# EAGLE schematic V1-MOUSE-REVIEW (EAGLE 9.7.0)
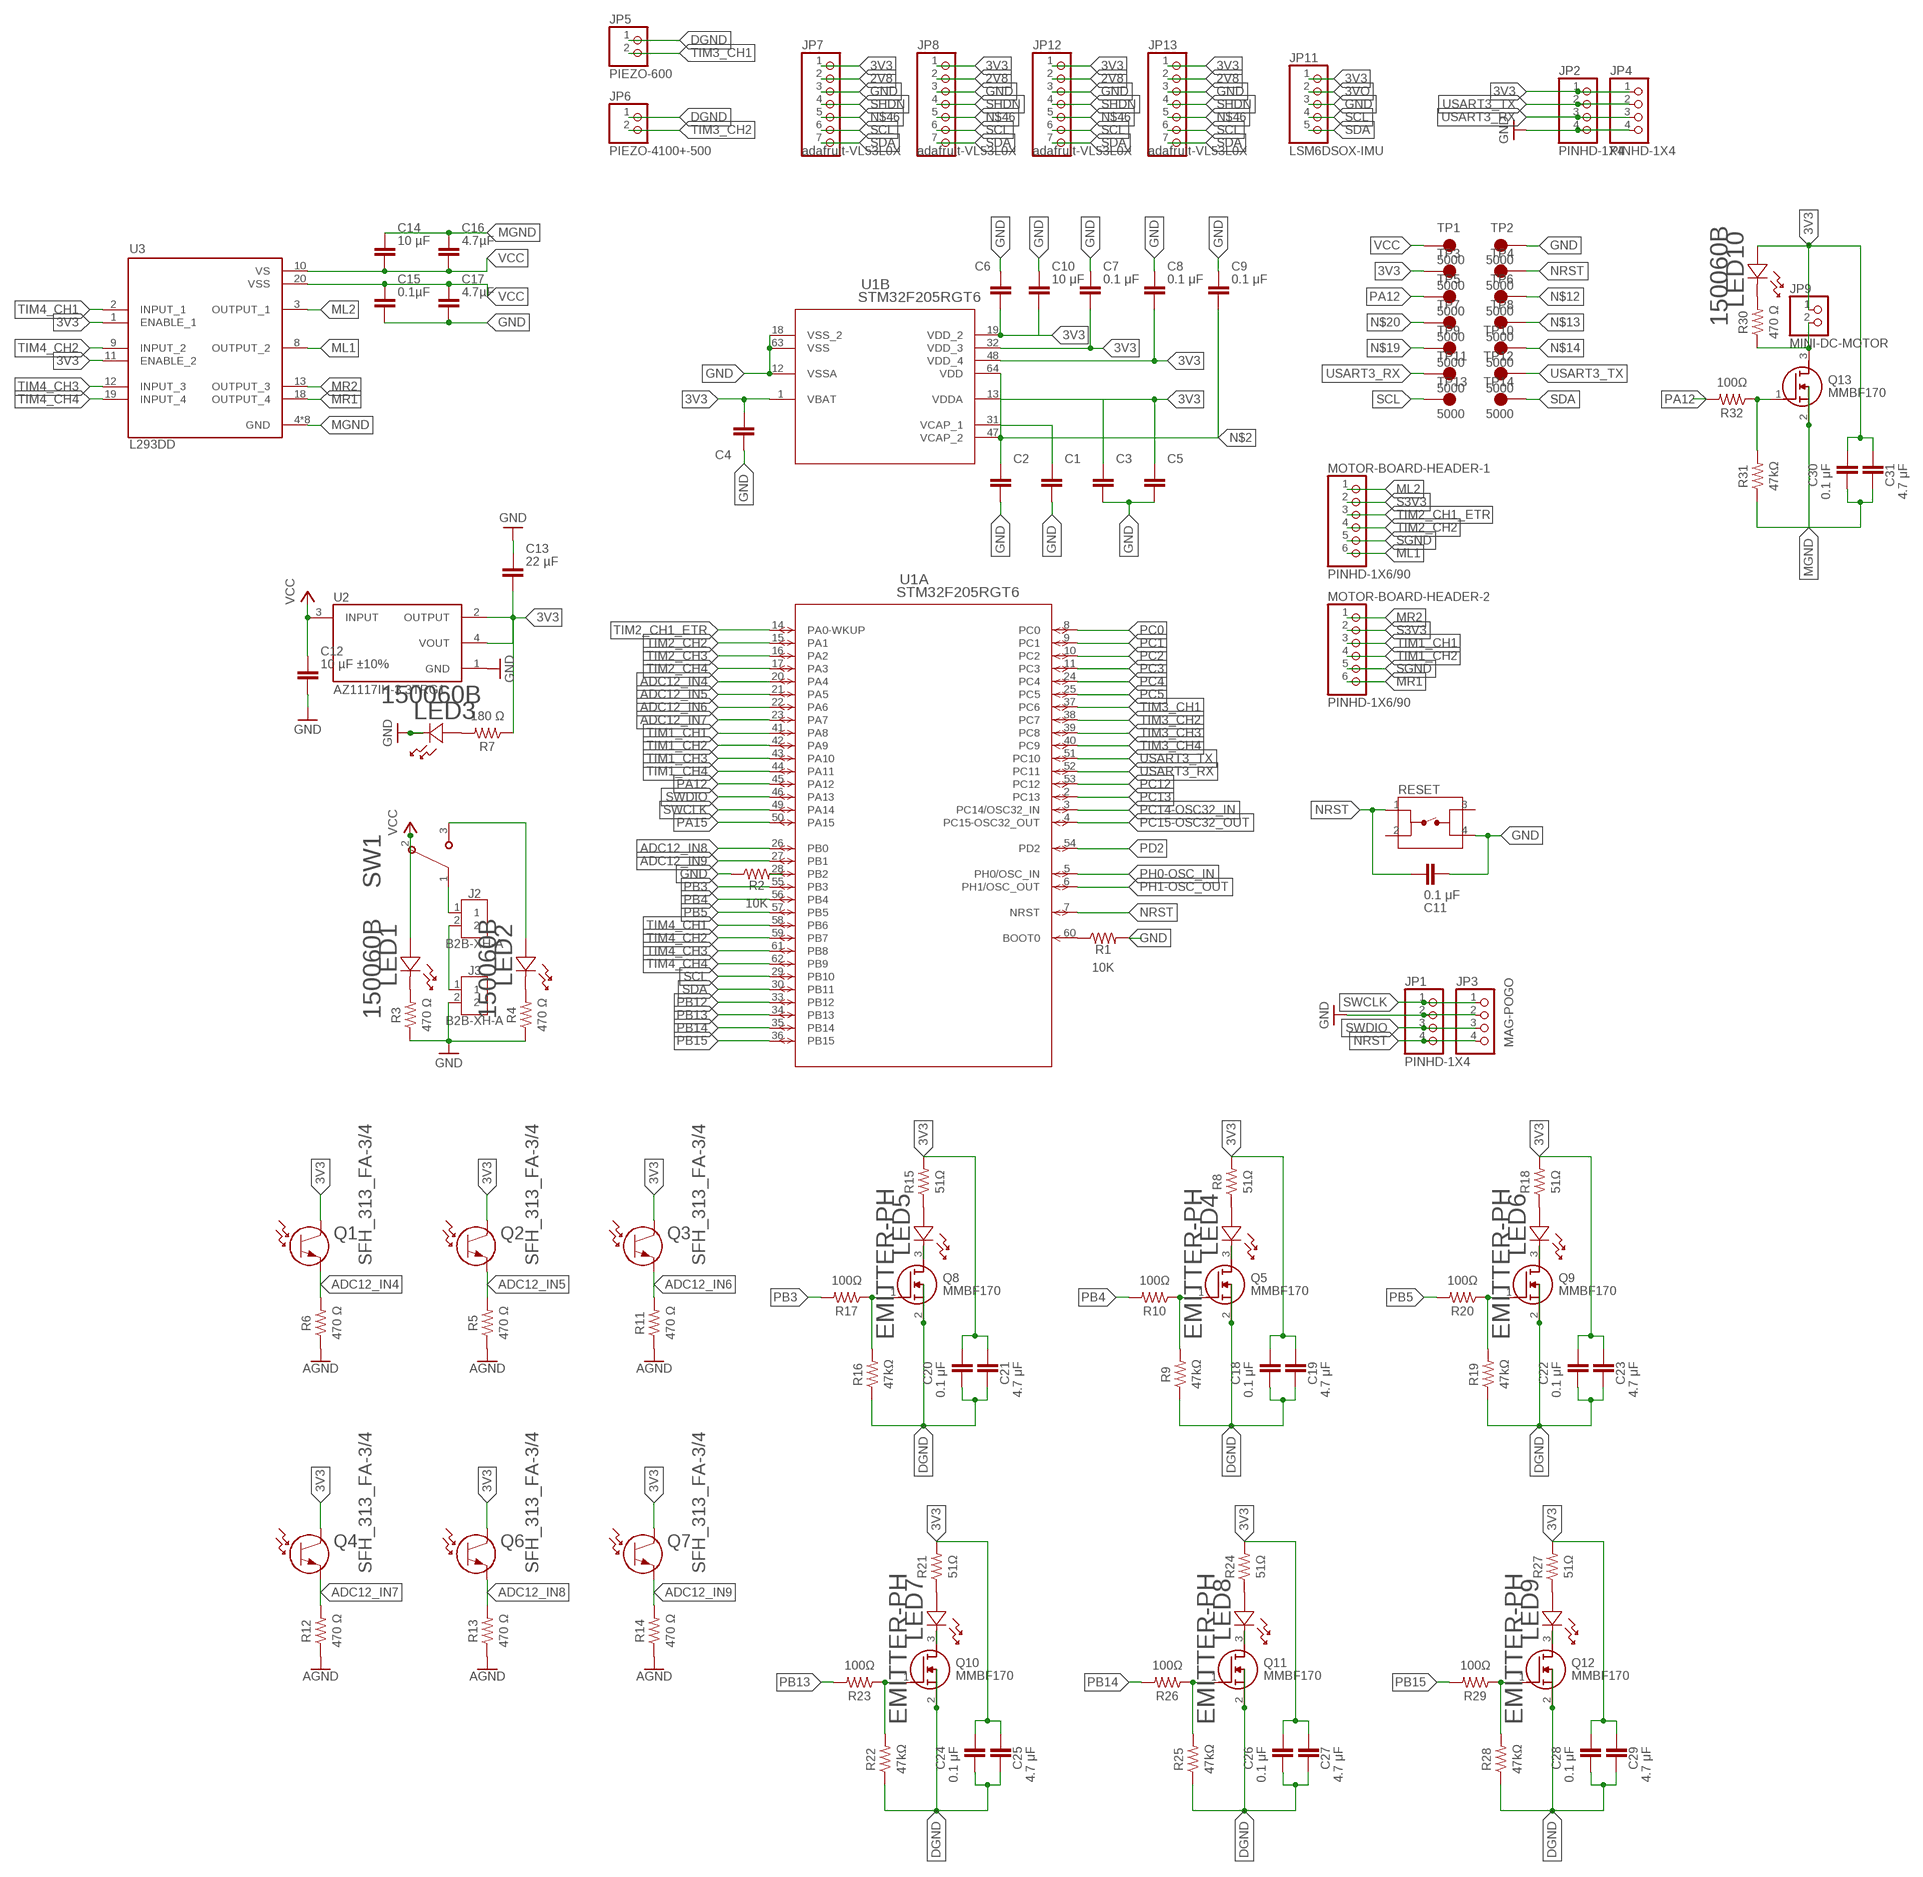
[diagram p0: schematic, sheet 1]

## Parts
C1  2.2 μF  C_CHIP-0603(1608-METRIC)  [CAPC1608X85]
C2  2.2 μF  C_CHIP-0603(1608-METRIC)  [CAPC1608X85]
C3  0.1 μF  C_CHIP-0603(1608-METRIC)  [CAPC1608X85]
C4  0.1 μF  C_CHIP-0603(1608-METRIC)  [CAPC1608X85]
C5  1 μF  C_CHIP-0603(1608-METRIC)  [CAPC1608X85]
C6  0.1 μF  C_CHIP-0603(1608-METRIC)  [CAPC1608X85]
C7  0.1 μF  C_CHIP-0603(1608-METRIC)  [CAPC1608X85]
C8  0.1 μF  C_CHIP-0603(1608-METRIC)  [CAPC1608X85]
C9  0.1 μF  C_CHIP-0603(1608-METRIC)  [CAPC1608X85]
C10  10 μF  C_CHIP-0603(1608-METRIC)  [CAPC1608X85]
C11  0.1 μF  C_CHIP-0603(1608-METRIC)  [CAPC1608X85]
C12  10 µF ±10%  C_CHIP-0603(1608-METRIC)  [CAPC1608X85]
C13  22 µF  C_CHIP-0603(1608-METRIC)  [CAPC1608X85]
C14  10 µF  C_CHIP-0603(1608-METRIC)  [CAPC1608X85]
C15  0.1µF  C_CHIP-0603(1608-METRIC)  [CAPC1608X85]
C16  4.7µF  C_CHIP-0603(1608-METRIC)  [CAPC1608X85]
C17  4.7µF  C_CHIP-0603(1608-METRIC)  [CAPC1608X85]
C18  0.1 μF  C_CHIP-0603(1608-METRIC)  [CAPC1608X85]
C19  4.7 μF  C_CHIP-0603(1608-METRIC)  [CAPC1608X85]
C20  0.1 μF  C_CHIP-0603(1608-METRIC)  [CAPC1608X85]
C21  4.7 μF  C_CHIP-0603(1608-METRIC)  [CAPC1608X85]
C22  0.1 μF  C_CHIP-0603(1608-METRIC)  [CAPC1608X85]
C23  4.7 μF  C_CHIP-0603(1608-METRIC)  [CAPC1608X85]
C24  0.1 μF  C_CHIP-0603(1608-METRIC)  [CAPC1608X85]
C25  4.7 μF  C_CHIP-0603(1608-METRIC)  [CAPC1608X85]
C26  0.1 μF  C_CHIP-0603(1608-METRIC)  [CAPC1608X85]
C27  4.7 μF  C_CHIP-0603(1608-METRIC)  [CAPC1608X85]
C28  0.1 μF  C_CHIP-0603(1608-METRIC)  [CAPC1608X85]
C29  4.7 μF  C_CHIP-0603(1608-METRIC)  [CAPC1608X85]
C30  0.1 μF  C_CHIP-0603(1608-METRIC)  [CAPC1608X85]
C31  4.7 μF  C_CHIP-0603(1608-METRIC)  [CAPC1608X85]
J2  B2B-XH-A  [B2B-XH-A]
J3  B2B-XH-A  [B2B-XH-A]
JP1  PINHD-1X4  [1X04]
JP2  PINHD-1X4  [1X04]
JP3  MAG-POGO  PINHD-1X4  [1X04]
JP4  PINHD-1X4  [1X04]
JP5  PIEZO-600  PINHD-1X2/90  [1X02/90]
JP6  PIEZO-4100+-500  PINHD-1X2/90  [1X02/90]
JP7  adafruit-VL53L0X  PINHD-1X7/90  [1X07/90]
JP8  adafruit-VL53L0X  PINHD-1X7/90  [1X07/90]
JP9  MINI-DC-MOTOR  PINHD-1X2  [1X02]
JP11  LSM6DSOX-IMU  PINHD-1X55X2MM  [1_05X2MM]
JP12  adafruit-VL53L0X  PINHD-1X7/90  [1X07/90]
JP13  adafruit-VL53L0X  PINHD-1X7/90  [1X07/90]
LED1  150060B  150060VS55040LED_150060B_WRE-L  [LED_150060B_WRE-L]
LED2  150060B  150060VS55040LED_150060B_WRE-L  [LED_150060B_WRE-L]
LED3  150060B  150060VS55040LED_150060B_WRE-L  [LED_150060B_WRE-L]
LED4  EMITTER-PH  B1911PG--20D000514U1930LED_B1911PG--20D000514U1930_01  [LED_B1911PG--20D000514U1930_01]
LED5  EMITTER-PH  B1911PG--20D000514U1930LED_B1911PG--20D000514U1930_01  [LED_B1911PG--20D000514U1930_01]
LED6  EMITTER-PH  B1911PG--20D000514U1930LED_B1911PG--20D000514U1930_01  [LED_B1911PG--20D000514U1930_01]
LED7  EMITTER-PH  B1911PG--20D000514U1930LED_B1911PG--20D000514U1930_01  [LED_B1911PG--20D000514U1930_01]
LED8  EMITTER-PH  B1911PG--20D000514U1930LED_B1911PG--20D000514U1930_01  [LED_B1911PG--20D000514U1930_01]
LED9  EMITTER-PH  B1911PG--20D000514U1930LED_B1911PG--20D000514U1930_01  [LED_B1911PG--20D000514U1930_01]
LED10  150060B  150060VS55040LED_150060B_WRE-L  [LED_150060B_WRE-L]
MOTOR-BOARD-HEADER-1  PINHD-1X6/90  [1X06/90]
MOTOR-BOARD-HEADER-2  PINHD-1X6/90  [1X06/90]
Q1  SFH_313_FA-3/4  SFH_313_FA-3/4SFH_313_FA-3/4_OSR  [SFH_313_FA-3/4_OSR]
Q2  SFH_313_FA-3/4  SFH_313_FA-3/4SFH_313_FA-3/4_OSR  [SFH_313_FA-3/4_OSR]
Q3  SFH_313_FA-3/4  SFH_313_FA-3/4SFH_313_FA-3/4_OSR  [SFH_313_FA-3/4_OSR]
Q4  SFH_313_FA-3/4  SFH_313_FA-3/4SFH_313_FA-3/4_OSR  [SFH_313_FA-3/4_OSR]
Q5  MMBF170  [SOT96P237X111-3N]
Q6  SFH_313_FA-3/4  SFH_313_FA-3/4SFH_313_FA-3/4_OSR  [SFH_313_FA-3/4_OSR]
Q7  SFH_313_FA-3/4  SFH_313_FA-3/4SFH_313_FA-3/4_OSR  [SFH_313_FA-3/4_OSR]
Q8  MMBF170  [SOT96P237X111-3N]
Q9  MMBF170  [SOT96P237X111-3N]
Q10  MMBF170  [SOT96P237X111-3N]
Q11  MMBF170  [SOT96P237X111-3N]
Q12  MMBF170  [SOT96P237X111-3N]
Q13  MMBF170  [SOT96P237X111-3N]
R1  10K  R-US_CHIP-0603(1608-METRIC)  [RESC1608X60]
R2  10K  R-US_CHIP-0603(1608-METRIC)  [RESC1608X60]
R3  470 Ω  R-US_CHIP-0603(1608-METRIC)  [RESC1608X60]
R4  470 Ω  R-US_CHIP-0603(1608-METRIC)  [RESC1608X60]
R5  470 Ω  R-US_CHIP-0603(1608-METRIC)  [RESC1608X60]
R6  470 Ω  R-US_CHIP-0603(1608-METRIC)  [RESC1608X60]
R7  180 Ω  R-US_CHIP-0603(1608-METRIC)  [RESC1608X60]
R8  51Ω  R-US_CHIP-0603(1608-METRIC)  [RESC1608X60]
R9  47kΩ  R-US_CHIP-0603(1608-METRIC)  [RESC1608X60]
R10  100Ω  R-US_CHIP-0603(1608-METRIC)  [RESC1608X60]
R11  470 Ω  R-US_CHIP-0603(1608-METRIC)  [RESC1608X60]
R12  470 Ω  R-US_CHIP-0603(1608-METRIC)  [RESC1608X60]
R13  470 Ω  R-US_CHIP-0603(1608-METRIC)  [RESC1608X60]
R14  470 Ω  R-US_CHIP-0603(1608-METRIC)  [RESC1608X60]
R15  51Ω  R-US_CHIP-0603(1608-METRIC)  [RESC1608X60]
R16  47kΩ  R-US_CHIP-0603(1608-METRIC)  [RESC1608X60]
R17  100Ω  R-US_CHIP-0603(1608-METRIC)  [RESC1608X60]
R18  51Ω  R-US_CHIP-0603(1608-METRIC)  [RESC1608X60]
R19  47kΩ  R-US_CHIP-0603(1608-METRIC)  [RESC1608X60]
R20  100Ω  R-US_CHIP-0603(1608-METRIC)  [RESC1608X60]
R21  51Ω  R-US_CHIP-0603(1608-METRIC)  [RESC1608X60]
R22  47kΩ  R-US_CHIP-0603(1608-METRIC)  [RESC1608X60]
R23  100Ω  R-US_CHIP-0603(1608-METRIC)  [RESC1608X60]
R24  51Ω  R-US_CHIP-0603(1608-METRIC)  [RESC1608X60]
R25  47kΩ  R-US_CHIP-0603(1608-METRIC)  [RESC1608X60]
R26  100Ω  R-US_CHIP-0603(1608-METRIC)  [RESC1608X60]
R27  51Ω  R-US_CHIP-0603(1608-METRIC)  [RESC1608X60]
R28  47kΩ  R-US_CHIP-0603(1608-METRIC)  [RESC1608X60]
R29  100Ω  R-US_CHIP-0603(1608-METRIC)  [RESC1608X60]
R30  470 Ω  R-US_CHIP-0603(1608-METRIC)  [RESC1608X60]
R31  47kΩ  R-US_CHIP-0603(1608-METRIC)  [RESC1608X60]
R32  100Ω  R-US_CHIP-0603(1608-METRIC)  [RESC1608X60]
RESET  FSM4JSMA  [TE_FSM4JSMA]
SW1  EG1218SW_1218_EWI  [SW_1218_EWI]
TP1  5000  [KEYSTONE_5000]
TP2  5000  [KEYSTONE_5000]
TP3  5000  [KEYSTONE_5000]
TP4  5000  [KEYSTONE_5000]
TP5  5000  [KEYSTONE_5000]
TP6  5000  [KEYSTONE_5000]
TP7  5000  [KEYSTONE_5000]
TP8  5000  [KEYSTONE_5000]
TP9  5000  [KEYSTONE_5000]
TP10  5000  [KEYSTONE_5000]
TP11  5000  [KEYSTONE_5000]
TP12  5000  [KEYSTONE_5000]
TP13  5000  [KEYSTONE_5000]
TP14  5000  [KEYSTONE_5000]
U1  STM32F205RGT6  [LQFP64-10X10MM]
U2  AZ1117IH-3.3TRG1  [SOT230P700X185-4N]
U3  L293DD  [SOIC127P1032X265-20N]

## Nets
2V8: JP7.2 JP8.2 JP12.2 JP13.2
3V3: C3.1 C4.2 C5.1 C6.2 C7.2 C8.2 C10.2 C13.2 C18.2 C19.2 C20.2 C21.2 C22.2 C23.2 C24.2 C25.2 C26.2 C27.2 C28.2 C29.2 C30.2 C31.2 JP2.1 JP4.1 JP7.1 JP8.1 JP9.1 JP11.1 JP12.1 JP13.1 LED10.2 Q1.2 Q2.2 Q3.2 Q4.2 Q6.2 Q7.2 R7.1 R8.2 R15.2 R18.2 R21.2 R24.2 R27.2 TP3.TP U1.1(B:VBAT) U1.13(B:VDDA) U1.19(B:VDD_2) U1.32(B:VDD_3) U1.48(B:VDD_4) U2.2(OUTPUT) U2.4(VOUT) U3.1(ENABLE_1) U3.11(ENABLE_2)
3VO: JP11.2
ADC12_IN4: Q1.1 R6.2 U1.20(A:PA4)
ADC12_IN5: Q2.1 R5.2 U1.21(A:PA5)
ADC12_IN6: Q3.1 R11.2 U1.22(A:PA6)
ADC12_IN7: Q4.1 R12.2 U1.23(A:PA7)
ADC12_IN8: Q6.1 R13.2 U1.26(A:PB0)
ADC12_IN9: Q7.1 R14.2 U1.27(A:PB1)
AGND: R5.1 R6.1 R11.1 R12.1 R13.1 R14.1
DGND: C18.1 C19.1 C20.1 C21.1 C22.1 C23.1 C24.1 C25.1 C26.1 C27.1 C28.1 C29.1 C30.1 C31.1 JP5.1 JP6.1 Q5.2(S) Q8.2(S) Q9.2(S) Q10.2(S) Q11.2(S) Q12.2(S) R9.1 R16.1 R19.1 R22.1 R25.1 R28.1 R31.1
GND: C1.2 C2.2 C3.2 C4.1 C5.2 C6.1 C7.1 C8.1 C9.1 C10.1 C11.1 C12.2 C13.1 C15.2 C17.2 J3.2 JP1.2 JP2.4 JP3.2 JP4.4 JP7.3 JP8.3 JP11.3 JP12.3 JP13.3 LED3.1 R1.2 R2.1 R3.1 R4.1 RESET.4 TP2.TP U1.12(B:VSSA) U1.18(B:VSS_2) U1.63(B:VSS) U2.1(GND)
MGND: C14.1 C16.1 Q13.2(S) U3.4(GND) U3.5(GND) U3.6(GND) U3.7(GND) U3.14(GND) U3.15(GND) U3.16(GND) U3.17(GND)
ML1: MOTOR-BOARD-HEADER-1.6 U3.8(OUTPUT_2)
ML2: MOTOR-BOARD-HEADER-1.1 U3.3(OUTPUT_1)
MR1: MOTOR-BOARD-HEADER-2.6 U3.18(OUTPUT_4)
MR2: MOTOR-BOARD-HEADER-2.1 U3.13(OUTPUT_3)
N$1: C1.1 U1.31(B:VCAP_1)
N$2: C2.1 C9.2 U1.47(B:VCAP_2) U1.64(B:VDD)
N$3: R1.1 U1.60(A:BOOT0)
N$4: R2.2 U1.28(A:PB2)
N$5: J2.2 J3.1
N$6: J2.1 SW1.1
N$7: LED1.1 R3.2
N$8: LED2.1 R4.2
N$9: LED2.2 SW1.3
N$10: JP9.2 Q13.3(D) R30.1
N$12: TP6.TP
N$13: TP8.TP
N$14: TP10.TP
N$16: Q13.1(G) R31.2 R32.1
N$17: LED10.1 R30.2
N$19: TP9.TP
N$20: TP7.TP
N$22: LED3.2 R7.2
N$27: LED4.1 Q5.3(D)
N$28: Q5.1(G) R9.2 R10.1
N$29: LED4.2 R8.1
N$30: LED5.2 R15.1
N$31: Q8.1(G) R16.2 R17.1
N$32: LED5.1 Q8.3(D)
N$33: LED6.1 Q9.3(D)
N$35: Q9.1(G) R19.2 R20.1
N$36: LED6.2 R18.1
N$37: LED7.1 Q10.3(D)
N$38: Q10.1(G) R22.2 R23.1
N$39: LED8.1 Q11.3(D)
N$40: Q11.1(G) R25.2 R26.1
N$41: LED9.1 Q12.3(D)
N$42: Q12.1(G) R28.2 R29.1
N$43: LED7.2 R21.1
N$44: LED8.2 R24.1
N$45: LED9.2 R27.1
N$46: JP7.5 JP8.5 JP12.5 JP13.5
NRST: C11.2 JP1.4 JP3.4 RESET.1 TP4.TP U1.7(A:NRST)
PA12: R32.2 TP5.TP U1.45(A:PA12)
PA15: U1.50(A:PA15)
PB3: R17.2 U1.55(A:PB3)
PB4: R10.2 U1.56(A:PB4)
PB5: R20.2 U1.57(A:PB5)
PB12: U1.33(A:PB12)
PB13: R23.2 U1.34(A:PB13)
PB14: R26.2 U1.35(A:PB14)
PB15: R29.2 U1.36(A:PB15)
PC0: U1.8(A:PC0)
PC1: U1.9(A:PC1)
PC2: U1.10(A:PC2)
PC3: U1.11(A:PC3)
PC4: U1.24(A:PC4)
PC5: U1.25(A:PC5)
PC12: U1.53(A:PC12)
PC13: U1.2(A:PC13)
PC14-OSC32_IN: U1.3(A:PC14/OSC32_IN)
PC15-OSC32_OUT: U1.4(A:PC15-OSC32_OUT)
PD2: U1.54(A:PD2)
PH0-OSC_IN: U1.5(A:PH0/OSC_IN)
PH1-OSC_OUT: U1.6(A:PH1/OSC_OUT)
S3V3: MOTOR-BOARD-HEADER-1.2 MOTOR-BOARD-HEADER-2.2
SCL: JP7.6 JP8.6 JP11.4 JP12.6 JP13.6 TP13.TP U1.29(A:PB10)
SDA: JP7.7 JP8.7 JP11.5 JP12.7 JP13.7 TP14.TP U1.30(A:PB11)
SGND: MOTOR-BOARD-HEADER-1.5 MOTOR-BOARD-HEADER-2.5
SHDN: JP7.4 JP8.4 JP12.4 JP13.4
SWCLK: JP1.1 JP3.1 U1.49(A:PA14)
SWDIO: JP1.3 JP3.3 U1.46(A:PA13)
TIM1_CH1: MOTOR-BOARD-HEADER-2.3 U1.41(A:PA8)
TIM1_CH2: MOTOR-BOARD-HEADER-2.4 U1.42(A:PA9)
TIM1_CH3: U1.43(A:PA10)
TIM1_CH4: U1.44(A:PA11)
TIM2_CH1_ETR: MOTOR-BOARD-HEADER-1.3 U1.14(A:PA0-WKUP)
TIM2_CH2: MOTOR-BOARD-HEADER-1.4 U1.15(A:PA1)
TIM2_CH3: U1.16(A:PA2)
TIM2_CH4: U1.17(A:PA3)
TIM3_CH1: JP5.2 U1.37(A:PC6)
TIM3_CH2: JP6.2 U1.38(A:PC7)
TIM3_CH3: U1.39(A:PC8)
TIM3_CH4: U1.40(A:PC9)
TIM4_CH1: U1.58(A:PB6) U3.2(INPUT_1)
TIM4_CH2: U1.59(A:PB7) U3.9(INPUT_2)
TIM4_CH3: U1.61(A:PB8) U3.12(INPUT_3)
TIM4_CH4: U1.62(A:PB9) U3.19(INPUT_4)
USART3_RX: JP2.3 JP4.3 TP11.TP U1.52(A:PC11)
USART3_TX: JP2.2 JP4.2 TP12.TP U1.51(A:PC10)
VCC: C12.1 C14.2 C15.1 C16.2 C17.1 LED1.2 SW1.2 TP1.TP U2.3(INPUT) U3.10(VS) U3.20(VSS)
Unconnected: RESET.2 RESET.3

## Library data of the parts
C1-C6 C12-C17 = Capacitor:C: Capacitor - Generic; CATEGORY: Capacitor
C7-C11 C18-C31 = Capacitor2:C: Capacitor - Generic; CATEGORY: Capacitor
J2 J3 = Connector:B2B-XH-A: XH Connector Top Entry - 2POS Details see: Datasheet <http://www.jst-mfg.com/product/pdf/eng/eXH.pdf>; CATEGORY: Header; DESCRIPTION: Connector Header Through Hole 2 position 0.098" (2.50mm); MANUFACTURER: JST Sales America Inc.; MPN: B2B-XH-A(LF)(SN); OPERATING_TEMPERATURE: -25°C ~ 85°C; PART_STATUS: ACTIVE; PITCH: 0.098" (2.50mm); ROHS_COMPLIANCE: ROHS3 Compliant; SERIES: XH; SUB_CATEGORY: Rectangular Connectors; TYPE: Header, Male Pin, Board to Cable/Wire, Through Hole
JP1-JP4 = Connector:PINHD-1X4: PIN HEADER; CATEGORY: Headers; DESCRIPTION: Header, Straight, 4 Position; MANUFACTURER: Generic; MPN: Generic; OPERATING_TEMPERATURE: Generic; PART_STATUS: Active; PITCH: 0.100" (2.54mm); ROHS_COMPLIANCE: Generic; SERIES: Generic; SUB-CATEGORY: Headers, Male Pins; TYPE: Board to Board or Cable, Unshrouded, Through Hole, Straight
JP5 JP6 = Connector:PINHD-1X2: PIN HEADER; CATEGORY: Headers; DESCRIPTION: Header, Right Angle, 2 Position; MANUFACTURER: Generic; MPN: Generic; OPERATING_TEMPERATURE: Generic; PART_STATUS: Active; PITCH: 0.100" (2.54mm); ROHS_COMPLIANCE: Generic; SERIES: Generic; SUB-CATEGORY: Headers, Male Pins; TYPE: Board to Board or Cable, Unshrouded, Through Hole, Right Angle
JP7 JP8 JP12 JP13 = Connector:PINHD-1X7: PIN HEADER; CATEGORY: Headers; DESCRIPTION: Header, Right Angle, 7 Position; MANUFACTURER: Generic; MPN: Generic; OPERATING_TEMPERATURE: Generic; PART_STATUS: Active; PITCH: 0.100" (2.54mm); ROHS_COMPLIANCE: Generic; SERIES: Generic; SUB-CATEGORY: Headers, Male Pins; TYPE: Board to Board or Cable, Unshrouded, Through Hole, Right Angle
JP9 = Connector:PINHD-1X2: PIN HEADER; CATEGORY: Headers; DESCRIPTION: Header, Straight, 2 Position; MANUFACTURER: Generic; MPN: Generic; OPERATING_TEMPERATURE: Generic; PART_STATUS: Active; PITCH: 0.100" (2.54mm); ROHS_COMPLIANCE: Generic; SERIES: Generic; SUB-CATEGORY: Headers, Male Pins; TYPE: Board to Board or Cable, Unshrouded, Through Hole, Straight
JP11 = Connector:PINHD-1X5: PIN HEADER; CATEGORY: Headers; DESCRIPTION: Header, Straight, 5 Position; MANUFACTURER: Generic; MPN: Generic; OPERATING_TEMPERATURE: Generic; PART_STATUS: Active; PITCH: 0.079" (2.00mm); ROHS_COMPLIANCE: Generic; SERIES: Generic; SUB-CATEGORY: Headers, Male Pins; TYPE: Board to Board or Cable, Unshrouded, Through Hole, Straight
LED1-LED3 LED10 = led:150060VS55040; COPYRIGHT: Copyright (C) 2024 Ultra Librarian. All rights reserved.; MANUFACTURER_PART_NUMBER: 150060VS55040; MFR_NAME: Wurth Electronics
LED4-LED9 = 2024-01-26_11-07-44_Library:B1911PG--20D000514U1930; COPYRIGHT: Copyright (C) 2024 Ultra Librarian. All rights reserved.; MANUFACTURER_PART_NUMBER: B1911PG--20D000514U1930; MFR_NAME: Harvatek; TYPE: LED Indication
MOTOR-BOARD-HEADER-1 MOTOR-BOARD-HEADER-2 = Connector:PINHD-1X6: PIN HEADER; CATEGORY: Headers; DESCRIPTION: Header, Right Angle, 6 Position; MANUFACTURER: Generic; MPN: Generic; OPERATING_TEMPERATURE: Generic; PART_STATUS: Active; PITCH: 0.100" (2.54mm); ROHS_COMPLIANCE: Generic; SERIES: Generic; SUB-CATEGORY: Headers, Male Pins; TYPE: Board to Board or Cable, Unshrouded, Through Hole, Right Angle
Q1-Q4 Q6 Q7 = 2024-01-26_13-06-00_Library:SFH_313_FA-3/4; COPYRIGHT: Copyright (C) 2024 Ultra Librarian. All rights reserved.; MANUFACTURER_PART_NUMBER: SFH 313 FA-3/4; MFR_NAME: OSRAM
Q5 Q8-Q13 = MMBF170:MMBF170: MMBF170 N-Channel MOSFET, 500 mA, 60 V, 3-Pin SOT-23 ON Semiconductor Source: Datasheet <https://www.onsemi.com/pub/Collateral/MMBF170-D.PDF>; ARROW_PART_NUMBER: MMBF170; ARROW_PRICE-STOCK: https://www.arrow.com/en/products/mmbf170/on-semiconductor?region=nac; DESCRIPTION: MMBF170 N-Channel MOSFET, 500 mA, 60 V, 3-Pin SOT-23 ON Semiconductor; HEIGHT: 1.11mm; MANUFACTURER_NAME: onsemi; MANUFACTURER_PART_NUMBER: MMBF170; MOUSER_PART_NUMBER: 512-MMBF170; MOUSER_PRICE-STOCK: https://www.mouser.co.uk/ProductDetail/onsemi-Fairchild/MMBF170?qs=FOlmdCx%252BAA2suHItufvdcg%3D%3D
R1 R2 = Resistor2:R-US: Resistor Fixed - ANSI; CATEGORY: Resistor; SUB-CATEGORY: Fixed
R3-R32 = Resistor:R-US: Resistor Fixed - ANSI; CATEGORY: Resistor; SUB-CATEGORY: Fixed
RESET = FSM4JSMA:FSM4JSMA: Switch Tactile OFF (ON) SPST Round Button Gull Wing 0.05A 24VDC 2.6N SMD T/R; COMMENT: 4-1437565-1; CONFIGURATION_POLE-THROW: Single Pole - Single Throw; CONTACT_CURRENT_RATING: 50 mA; DESCRIPTION: Tactile Switch SPST-NO Top Actuated Surface Mount; DIGI-KEY_PART_NUMBER: 450-1759-2-ND; EU_ROHS_COMPLIANCE: Compliant; MF: TE Connectivity; MP: FSM4JSMA; PACKAGE: None; PURCHASE-URL: https://pricing.snapeda.com/search/part/FSM4JSMA/?ref=eda
SW1 = switch:EG1218; COPYRIGHT: Copyright (C) 2024 Ultra Librarian. All rights reserved.; MANUFACTURER_PART_NUMBER: EG1218; MFR_NAME: E-Switch
TP1-TP14 = 5000-test-point:5000: Check availability <https://pricing.snapeda.com/parts/5000/Keystone%20Electronics/view-part?ref=eda> Check availability <https://pricing.snapeda.com/parts/5000/Keystone%20Electronics/view-part?ref=eda>; AVAILABILITY: In Stock; CHECK_PRICES: https://www.snapeda.com/parts/5000/Keystone+Electronics/view-part/?ref=eda; DESCRIPTION: Test Point Miniature THM H .300 Nylon 46 Insulated Red PhosBronze/Silver | Keystone Electronics 5000; MF: Keystone Electronics; MP: 5000; PACKAGE: Test Point Keystone Electronics; PRICE: None; PURCHASE-URL: https://www.snapeda.com/api/url_track_click_mouser/?unipart_id=883847&manufacturer=Keystone Electronics&part_name=5000&search_term=5000; SNAPEDA_LINK: https://www.snapeda.com/parts/5000/Keystone+Electronics/view-part/?ref=snap
U1 = stm32f205rgt6:STM32F205RGT6; COPYRIGHT: Copyright (C) 2021 Ultra Librarian. All rights reserved.; MANUFACTURER_PART_NUMBER: STM32F205RGT6; MFR_NAME: STMicroelectronics
U2 = AZ1117IH-3.3TRG1:AZ1117IH-3.3TRG1: Check availability <https://pricing.snapeda.com/parts/AZ1117IH-3.3TRG1/Diodes%20Inc./view-part?ref=eda>; AVAILABILITY: In Stock; CHECK_PRICES: https://www.snapeda.com/parts/AZ1117IH-3.3TRG1/Diodes+Inc./view-part/?ref=eda; DESCRIPTION: Linear Voltage Regulator IC Positive Fixed 1 Output 1A SOT-223-3; MF: Diodes Inc.; MP: AZ1117IH-3.3TRG1; PACKAGE: SOT-223 Diodes Inc.; PRICE: None; PURCHASE-URL: https://www.snapeda.com/api/url_track_click_mouser/?unipart_id=490259&manufacturer=Diodes Inc.&part_name=AZ1117IH-3.3TRG1&search_term=az1117ih-3.3trg1; SNAPEDA_LINK: https://www.snapeda.com/parts/AZ1117IH-3.3TRG1/Diodes+Inc./view-part/?ref=snap
U3 = L293DD:L293DD: L293DD Series Push - Pull Quad Channel Driver with Diodes - SOIC-20; MANUFACTURER: STMicroelectronics; PARTREV: N/A; STANDARD: IPC-7351B